# Altium schematic sheet medusa-ai-integrated-charger.SchDoc
size Legal; SheetNumber: 1; SheetTotal: 5
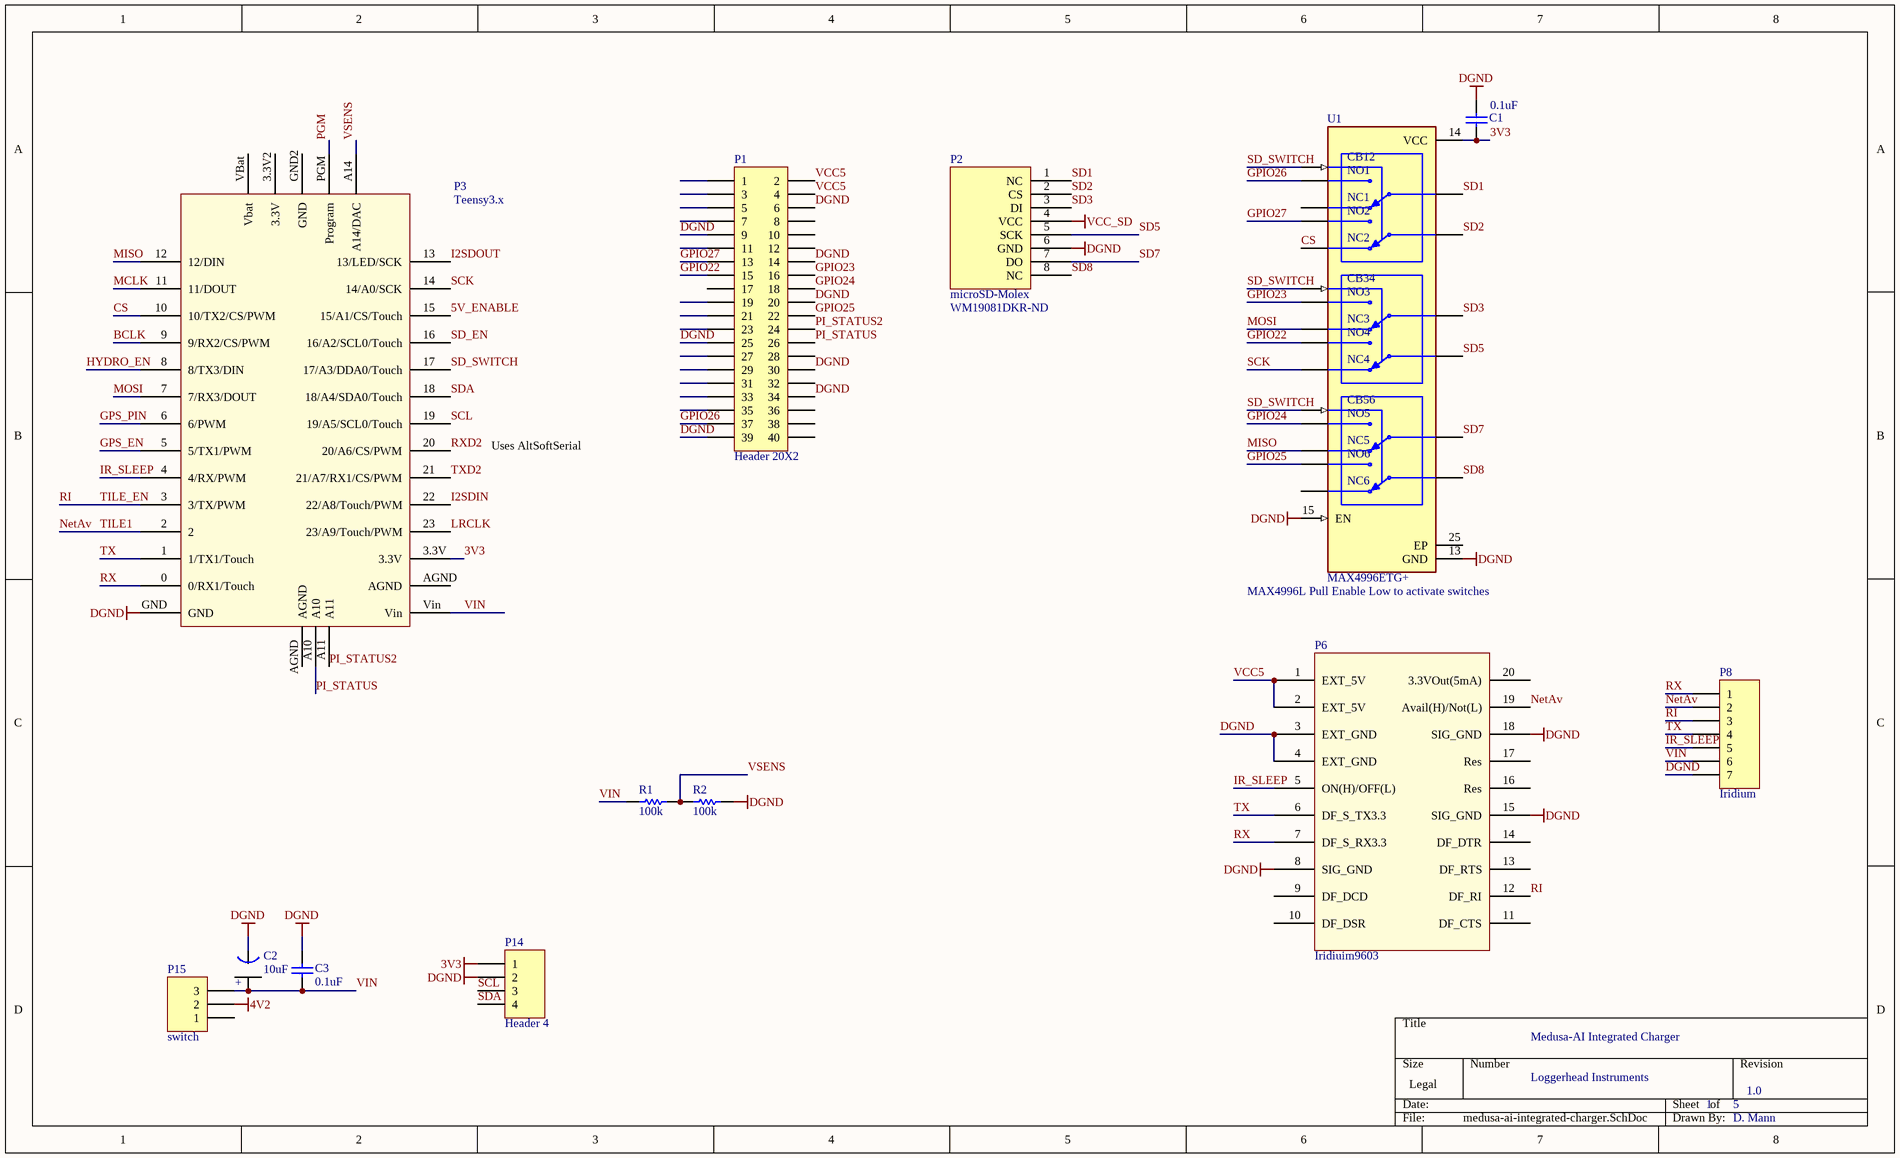
[diagram p0: medusa-ai-integrated-charger.SchDoc]

## Parts
C1  0.1uF  [0402]
C2  10uF  [Tant0805]
C3  0.1uF  [0402]
P1  Header 20X2  [HDR2X20]
P2  microSD-Molex  Supplier Part Number 1: WM19081DKR-ND  [microSD_Molex_hinged]
P3  Teensy3.x  [Teensy3.x]
P6  Iridiuim9603  [Iridium9603]
P8  Iridium  [HDR1X7]
P14  Header 4  [HDR1X4]
P15  switch  [HDR1X3]
R1  100k  [3-0603]
R2  100k  [3-0603]
U1  MAX4996ETG+  [QFN40P350X350X80-25N]

## Nets
3V3: C1.1 P3.3.3V P14.1 U1.14(VCC)
4V2: P15.2
DGND: C1.2 C2.1(GND) C3.2 P1.6 P1.9 P1.14 P1.20 P1.25 P1.30 P1.34 P1.39 P2.6(GND) P3.GND P6.3(EXT_GND) P6.4(EXT_GND) P6.8(SIG_GND) P6.15(SIG_GND) P6.18(SIG_GND) P8.7 P14.2 R2.1 U1.13(GND) U1.15(EN)
VCC_SD: P2.4(VCC)
5V_ENABLE: P3.15(15/A1/CS/Touch)
BCLK: P3.9(9/RX2/CS/PWM)
CS: P3.10(10/TX2/CS/PWM) U1.11(NC2)
GPIO22: P1.15 U1.22(NO4)
GPIO23: P1.16 U1.21(NO3)
GPIO24: P1.18 U1.23(NO5)
GPIO25: P1.22 U1.24(NO6)
GPIO26: P1.37 U1.19(NO1)
GPIO27: P1.13 U1.20(NO2)
GPS_EN: P3.5(5/TX1/PWM)
GPS_PIN: P3.6(6/PWM)
HYDRO_EN: P3.8(8/TX3/DIN)
I2SDIN: P3.22(22/A8/Touch/PWM)
I2SDOUT: P3.13(13/LED/SCK)
IR_SLEEP: P3.4(4/RX/PWM) P6.5(ON(H)/OFF(L)) P8.5
LRCLK: P3.23(23/A9/Touch/PWM)
MCLK: P3.11(11/DOUT)
MISO: P3.12(12/DIN) U1.8(NC5)
MOSI: P3.7(7/RX3/DOUT) U1.10(NC3)
NetAv: P3.2 P6.19(Avail(H)/Not(L)) P8.2  [also labelled TILE1]
PGM: P3.PGM(Program)
PI_STATUS: P1.26 P3.A10
PI_STATUS2: P1.24 P3.A11
RI: P3.3(3/TX/PWM) P6.12(DF_RI) P8.3  [also labelled TILE_EN]
RX: P3.0(0/RX1/Touch) P6.7(DF_S_RX3.3) P8.1
RXD2: P3.20(20/A6/CS/PWM)
SCK: P3.14(14/A0/SCK) U1.9(NC4)
SCL: P3.19(19/A5/SCL0/Touch) P14.3
SD1: P2.1(NC) U1.18(COM1)
SD2: P2.2(CS) U1.17(COM2)
SD3: P2.3(DI) U1.16(COM3)
SD5: P2.5(SCK) U1.4(COM4)
SD7: P2.7(DO) U1.5(COM5)
SD8: P2.8(NC) U1.6(COM6)
SD_EN: P3.16(16/A2/SCL0/Touch)
SD_SWITCH: P3.17(17/A3/DDA0/Touch) U1.1(CB12) U1.2(CB34) U1.3(CB56)
SDA: P3.18(18/A4/SDA0/Touch) P14.4
TX: P3.1(1/TX1/Touch) P6.6(DF_S_TX3.3) P8.4
TXD2: P3.21(21/A7/RX1/CS/PWM)
VCC5: P1.2 P1.4 P6.1(EXT_5V) P6.2(EXT_5V)
VIN: C2.2(+) C3.1 P3.Vin P8.6 P15.3 R1.2
VSENS: P3.A14(A14/DAC) R1.1 R2.2

Not connected (* = marked no-connect by the designer): P1 1 3 5 7 8 10 11 12 17 19 21 23 27 28 29 31 32 33 35 36 38 40; P3 3.3V2(3.3V) AGND GND2(GND) VBat(Vbat); P6 9(DF_DCD) 10(DF_DSR) 11(DF_CTS) 13(DF_RTS) 14(DF_DTR) 16(Res) 17(Res) 20(3.3VOut(5mA)); P15 1; U1 7(NC6) 12(NC1) 25(EP)

## Notes on the sheet
- Uses AltSoftSerial
- (near U1) MAX4996L Pull Enable Low to activate switches
- Medusa-AI Integrated Charger
- Loggerhead Instruments
- 1
- 5
- 1.0
- D. Mann

## Library data of the parts
C1 C3 = C0402: Ceramic Chip Capacitor - Standard; Note: Footprint corresponds to dimensions for bulk cassette packaging. This case size has tightened tolerances.; Published: 17-Jul-2002; LatestRevisionDate: 19-Mar-2004; LatestRevisionNote: Silkscreen size reduced.; DatasheetDocument: Mar-2001; PackageDocument: Mar-2001; PackageReference: 0402; Publisher: Altium Limited; Code_JEITA: 0402; Code_IPC: 1005 [0402]; ComponentLink1Description: Manufacturer Link; ComponentLink1URL: http://www.kemet.com/; ComponentLink2Description: Datasheet; ComponentLink2URL: http://www.kemet.com/kemet/web/homepage/kechome.nsf/vapubfilesname/F3102TA.pdf/$file/F3102TA.pdf; Value: 0.1uF
C2 = Tant0805: Value: 10uF
P1 = Header 20X2: Header, 20-Pin, Dual row; LatestRevisionDate: 17-Jul-2002; LatestRevisionNote: Re-released for DXP Platform.; Publisher: Altium Limited
P2 = microSD_Molex_hinged: Supplier 1: Digi-Key
P6 = IRIDIUM9603
P8 = Header 7: Header, 7-Pin; LatestRevisionDate: 17-Jul-2002; LatestRevisionNote: Re-released for DXP Platform.; Publisher: Altium Limited
P14 = Header 4: Header, 4-Pin; LatestRevisionDate: 17-Jul-2002; LatestRevisionNote: Re-released for DXP Platform.; Publisher: Altium Limited
P15 = Header 3: Header, 3-Pin; LatestRevisionDate: 17-Jul-2002; LatestRevisionNote: Re-released for DXP Platform.; Publisher: Altium Limited
R1 R2 = ERJ3RK: Precision Thick Film Chip Resistor, 10 Ohm to 1M Ohm Range, 1% and 0.5% Tolerance, 0603 Size, 0.063 W; Published: 17-Dec-2003; LatestRevisionDate: 19-Mar-2004; LatestRevisionNote: Silkscreen size reduced.; PackageDocument: Mar-2003; PackageReference: 3-0603; Publisher: Altium Limited; Code_IPC: 1608 [0603]; ComponentLink1Description: Manufacturer Link; ComponentLink1URL: http://www.panasonic.com/industrial/components/resistive_products.htm; ComponentLink2Description: Datasheet; ComponentLink2URL: http://www.panasonic.com/industrial/components/pdf/AOA0000CE2.pdf
U1 = MAX4996ETG+: 3 Circuit IC Switch 2:2 4Ohm 24-TQFN (4x4); MF: Maxim Integrated; SnapEDA_Link: https://www.snapeda.com/parts/MAX4996ETG+/Maxim%20Integrated/view-part/1193961/?ref=snap; Value: *; Purchase-URL: https://pricing.snapeda.com/search/part/MAX4996ETG+/?ref=eda; Price: None; Availability: Warning; Check_prices: https://www.snapeda.com/parts/MAX4996ETG+/Maxim%20Integrated/view-part/1193961/?ref=eda; MP: MAX4996ETG+; Package: TQFN-24 Maxim